# EAGLE schematic icontroller (EAGLE 5.02)
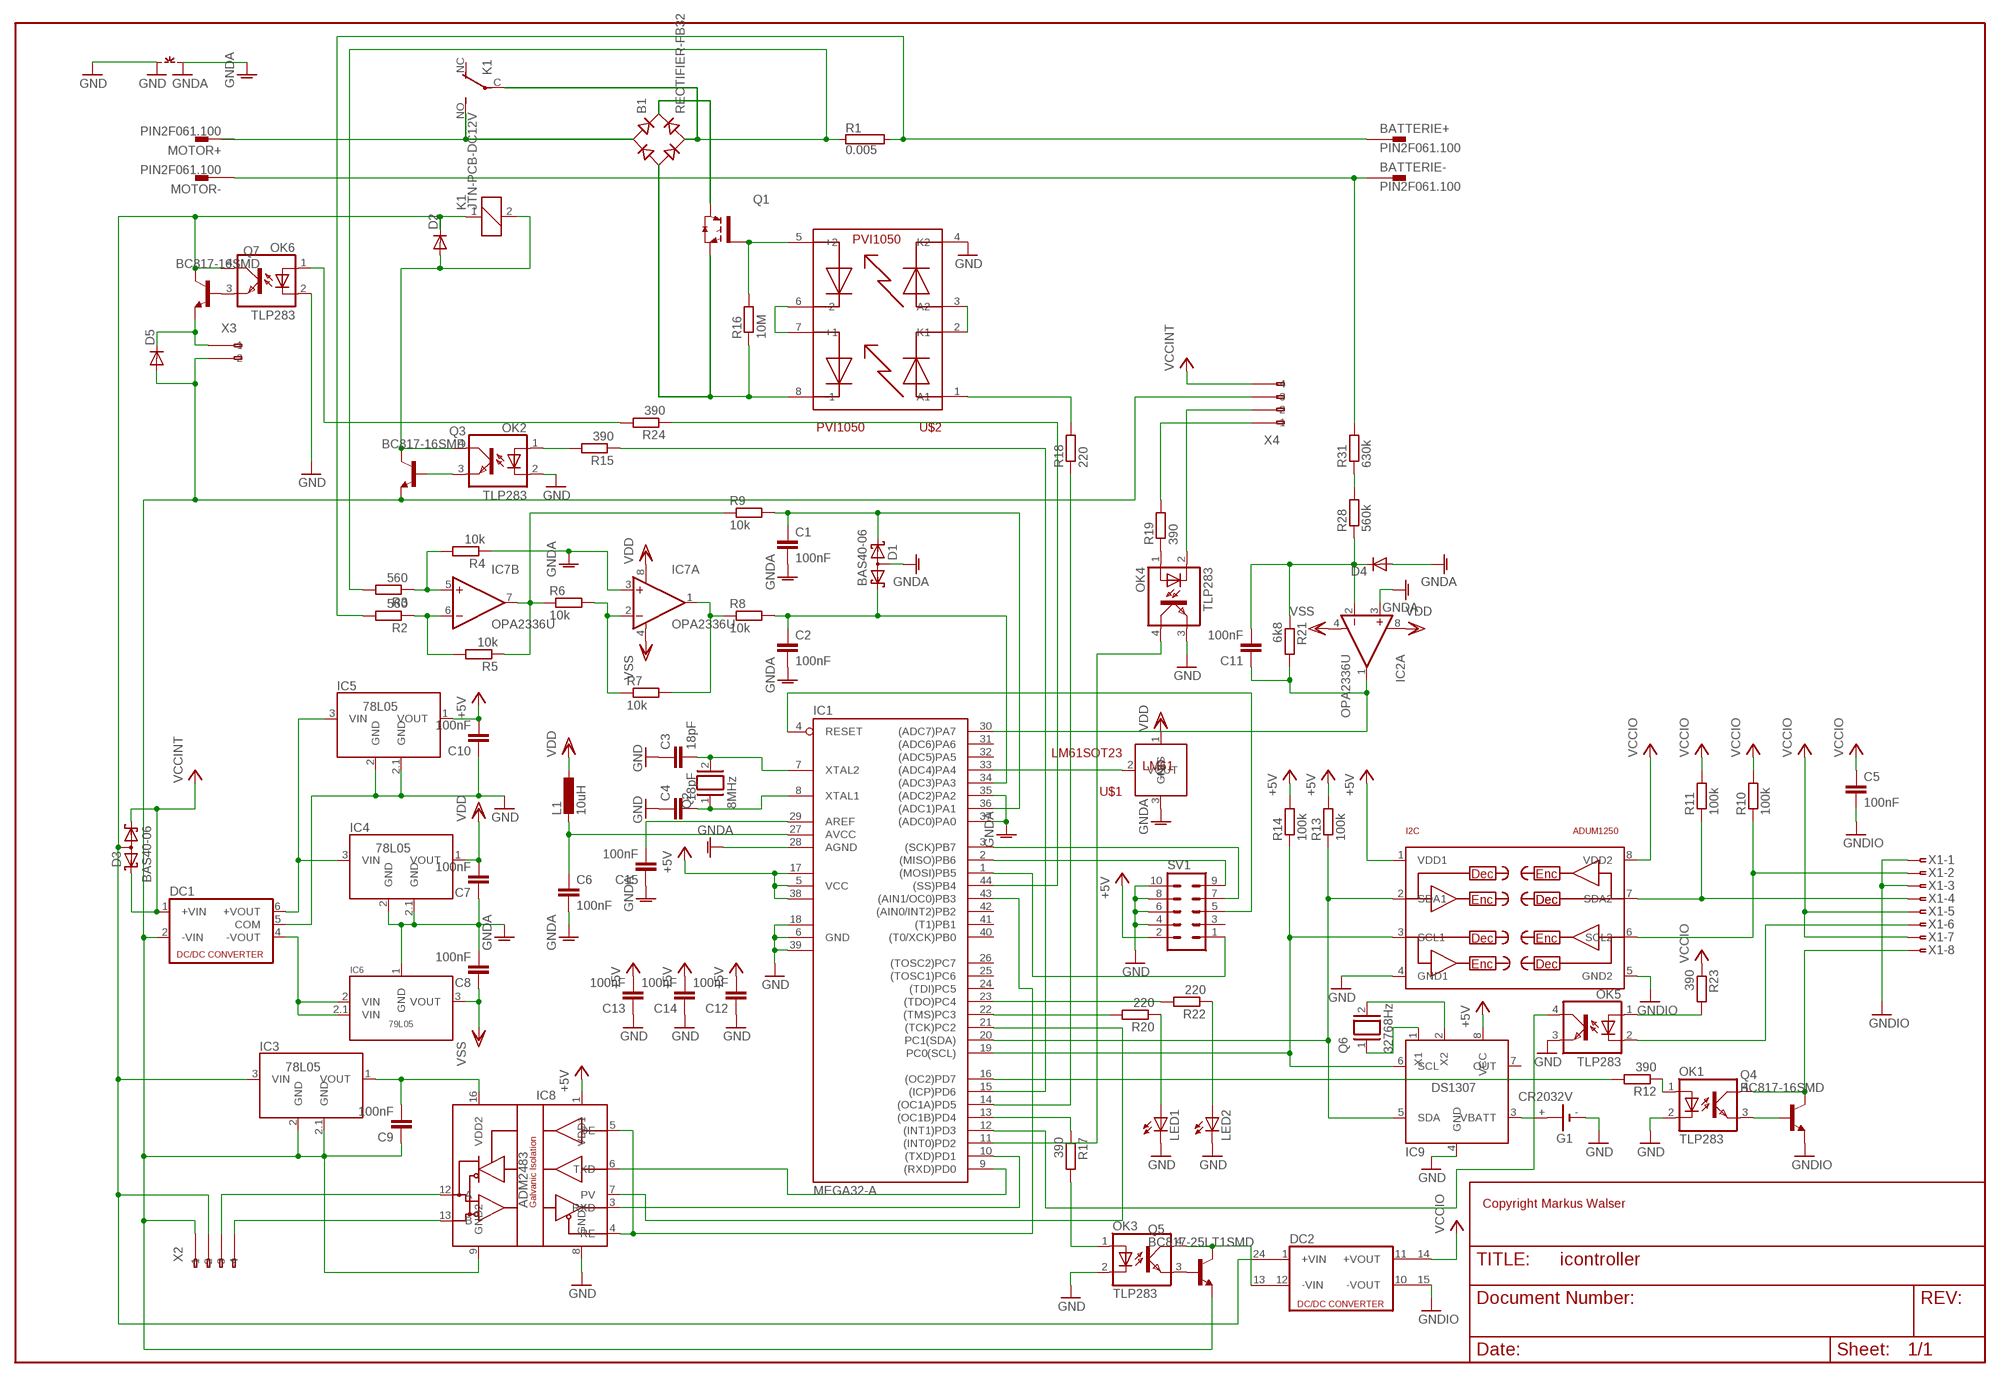
[diagram p0: schematic, sheet 1]

## Parts
B1  RECTIFIER-FB32  [FB32]
BATTERIE+  PIN2F061.100  [F061.100]
BATTERIE-  PIN2F061.100  [F061.100]
C1  100nF  C-EUC0603K  [C0603K]
C2  100nF  C-EUC0603K  [C0603K]
C3  18pF  C-EUC0603K  [C0603K]
C4  18pF  C-EUC0603K  [C0603K]
C5  100nF  C-EUC0603K  [C0603K]
C6  100nF  C-EUC0603K  [C0603K]
C7  100nF  C-EUC0603K  [C0603K]
C8  100nF  C-EUC0603K  [C0603K]
C9  100nF  C-EUC0603K  [C0603K]
C10  100nF  C-EUC0603K  [C0603K]
C11  100nF  C-EUC0603K  [C0603K]
C12  100nF  C-EUC0603K  [C0603K]
C13  100nF  C-EUC0603K  [C0603K]
C14  100nF  C-EUC0603K  [C0603K]
C15  100nF  C-EUC0603K  [C0603K]
D1  BAS40-06  [SOT23]
D2  DIODE-MICROMELF-R  [MICROMELF-R]
D3  BAS40-06  [SOT23]
D4  DIODE-MICROMELF-R  [MICROMELF-R]
D5  DIODE-MICROMELF-R  [MICROMELF-R]
DC1  NMA  [NMA]
DC2  DCW1U  [DCW]
G1  CR2032V  [CR2032V]
I2C  ADUM1250  [SO8]
IC1  MEGA32-A  [TQFP44]
IC2  OPA2336U  [SO08]
IC3  78L05  [SOT89]
IC4  78L05  [SOT89]
IC5  78L05  [SOT89]
IC6  79L05  [SOT89]
IC7  OPA2336U  [SO08]
IC8  ADM2483  [SO16W]
IC9  DS1307  [SO08]
K1  JTN-PCB-DC12V  [JT-PCB]
L1  10uH  L-EUL3225M  [L3225M]
LED1  LEDCHIPLED_0805  [CHIPLED_0805]
LED2  LEDCHIPLED_0805  [CHIPLED_0805]
MOTOR+  PIN2F061.100  [F061.100]
MOTOR-  PIN2F061.100  [F061.100]
OK1  TLP283  [MINI-FLAT-4]
OK2  TLP283  [MINI-FLAT-4]
OK3  TLP283  [MINI-FLAT-4]
OK4  TLP283  [MINI-FLAT-4]
OK5  TLP283  [MINI-FLAT-4]
OK6  TLP283  [MINI-FLAT-4]
Q1  IRG4BC15UD-S  [D2PACK]
Q2  8MHz  XTAL/S  [QS]
Q3  BC817-16SMD  [SOT23-BEC]
Q4  BC817-16SMD  [SOT23-BEC]
Q5  BC817-25LT1SMD  [SOT23-BEC]
Q6  32768Hz  XTAL/S  [QS]
Q7  BC817-16SMD  [SOT23-BEC]
R1  0.005  RKH206-8  [KH206-8]
R2  560  R-EU_M0805  [M0805]
R3  560  R-EU_M0805  [M0805]
R4  10k  R-EU_M0805  [M0805]
R5  10k  R-EU_M0805  [M0805]
R6  10k  R-EU_M0805  [M0805]
R7  10k  R-EU_M0805  [M0805]
R8  10k  R-EU_M0805  [M0805]
R9  10k  R-EU_M0805  [M0805]
R10  100k  R-EU_M0805  [M0805]
R11  100k  R-EU_M0805  [M0805]
R12  390  R-EU_M0805  [M0805]
R13  100k  R-EU_M0805  [M0805]
R14  100k  R-EU_M0805  [M0805]
R15  390  R-EU_M0805  [M0805]
R16  10M  R-EU_M0805  [M0805]
R17  390  R-EU_M0805  [M0805]
R18  220  R-EU_M0805  [M0805]
R19  390  R-EU_M0805  [M0805]
R20  220  R-EU_M0805  [M0805]
R21  6k8  R-EU_M0805  [M0805]
R22  220  R-EU_M0805  [M0805]
R23  390  R-EU_M0805  [M0805]
R24  390  R-EU_M0805  [M0805]
R28  560k  R-EU_MELF0207W  [MINI_MELF-0207W]
R31  630k  R-EU_MELF0207W  [MINI_MELF-0207W]
SV1  MA05-2  [MA05-2]
U$1  LM61SOT23  [SOT23]
U$2  PVI1050  [DIL08]
X1  FSIDE-8  [FSIDE-8]
X2  233-104  [233-104]
X3  233-102  [233-102]
X4  233-104  [233-104]
~NUDEV~1  GND-GNDA  [GND-GNDA]

## Nets
+5V: C10.2 C12.2 C13.2 C14.2 I2C.1(VDD1) IC1.5(VCC) IC1.17(VCC1) IC1.38(VCC2) IC5.1(VOUT) IC8.1(VDD1) IC9.8(VCC) R13.2 R14.2 SV1.2
GND: C3.1 C4.1 C10.1 C12.1 C13.1 C14.1 DC1.5(COM) G1.- I2C.4(GND1) IC1.6(GND) IC1.18(GND1) IC1.39(GND2) IC5.2(GND) IC5.2.1(GND) IC8.8(GND1) IC9.4(GND) LED1.C LED2.C OK1.2(C) OK2.2(C) OK3.2(C) OK4.3(EMIT) OK5.3(EMIT) OK6.2(C) SV1.4 SV1.6 SV1.8 SV1.10 U$2.4(K2) ~NUDEV~1.GND
GNDA: C1.2 C2.2 C6.2 C7.1 C8.2 C15.1 D1.3(AA) D4.A IC1.28(AGND) IC1.35((ADC2)PA2) IC1.37((ADC0)PA0) IC2.3(A:+IN) IC4.2(GND) IC4.2.1(GND) IC6.1(GND) IC7.3(A:+IN) R4.1 U$1.3(GND) ~NUDEV~1.GNDA
GNDIO: C5.2 DC2.15(-VOUT1) I2C.5(GND2) Q4.E X1.1 X1.3
N$1: B1.+ Q1.2(C)
N$2: B1.- Q1.3(E) R16.1 U$2.8(-1)
N$3: B1.AC2 K1.C(P) R1.1 R3.2
N$4: IC7.2(A:-IN) R6.2 R7.1
N$5: IC7.5(B:+IN) R3.1 R4.2
N$6: IC7.6(B:-IN) R2.1 R5.2
N$7: IC7.7(B:OUT) R5.1 R6.1 R9.1
N$8: IC7.1(A:OUT) R7.2 R8.1
N$9: DC1.4(-VOUT) IC6.2(VIN) IC6.2.1(VIN)
N$10: C1.1 D1.2(K2) IC1.36((ADC1)PA1) R9.2
N$11: C2.1 D1.1(K1) IC1.34((ADC3)PA3) R8.2
N$12: C3.2 IC1.7(XTAL2) Q2.2
N$13: C4.2 IC1.8(XTAL1) Q2.1
N$14: I2C.6(SCL2) R10.1 X1.2
N$15: I2C.7(SDA2) R11.1 X1.4
N$16: Q1.1(G) R16.2 U$2.5(+2)
N$17: OK1.4(COL) Q4.C X1.8
N$18: OK1.1(A) R12.1
N$19: IC1.16((OC2)PD7) R12.2
N$20: OK2.3(EMIT) Q3.B
N$21: OK2.1(A) R15.2
N$22: C6.1 IC1.27(AVCC) L1.2
N$23: I2C.2(SDA1) IC1.20(PC1(SDA)) IC9.5(SDA) R13.1
N$24: I2C.3(SCL1) IC1.19(PC0(SCL)) IC9.6(SCL) R14.1
N$25: IC1.15((ICP)PD6) R15.1
N$26: D2.C D3.3(AA) DC2.24(+VIN1) IC3.3(VIN) K1.1 OK6.4(COL) Q7.C X2.A2(-2)
N$27: C9.1 D5.A DC1.2(-VIN) IC3.2(GND) IC3.2.1(GND) IC8.9(GND2) Q3.E Q5.E X2.A1(-1) X3.A2(-2) X4.A3(-3)
N$28: D2.A K1.2 OK2.4(COL) Q3.C
N$29: OK1.3(EMIT) Q4.B
N$30: U$2.6(-2) U$2.7(+1)
N$31: IC1.14((OC1A)PD5) R18.1
N$32: R18.2 U$2.1(A1)
N$33: U$2.2(K1) U$2.3(A2)
N$34: IC1.9((RXD)PD0) IC8.6(TXD)
N$35: IC1.10((TXD)PD1) IC8.3(RXD)
N$36: IC8.13(B) X2.A4(-4)
N$37: C9.2 IC3.1(VOUT) IC8.16(VDD2)
N$38: IC8.12(A) X2.A3(-3)
N$39: IC1.43((AIN1/OC0)PB3) IC8.4(RE) IC8.5(DE)
N$40: IC1.21((TCK)PC2) IC8.7(PV)
N$41: BATTERIE-.A1 MOTOR-.A1 R31.2
N$42: R28.2 R31.1
N$44: DC2.13(-VIN1) OK3.4(COL) Q5.C
N$45: OK3.3(EMIT) Q5.B
N$46: OK3.1(A) R17.2
N$47: IC1.13((OC1B)PD4) R17.1
N$48: IC1.11((INT0)PD2) OK4.4(COL)
N$49: OK4.2(C) X4.A2(-2)
N$50: OK4.1(A) R19.1
N$51: G1.+ IC9.3(VBATT)
N$52: IC1.33((ADC4)PA4) U$1.2(VOUT)
N$53: IC1.3((SCK)PB7) SV1.7
N$54: IC1.4(RESET) SV1.5
N$55: IC1.1((MOSI)PB5) SV1.1
N$56: IC1.2((MISO)PB6) SV1.9
N$57: DC1.6(+VOUT) IC4.3(VIN) IC5.3(VIN)
N$58: R19.2 X4.A1(-1)
N$59: C15.2 IC1.29(AREF)
N$60: B1.AC1 K1.NO(S) MOTOR+.A1 MOTOR+.A2(1.1)
N$61: BATTERIE+.A1 R1.2 R2.2
N$62: IC9.1(X1) Q6.1
N$63: IC9.2(X2) Q6.2
N$64: LED2.A R22.1
N$65: IC1.23((TDO)PC4) R22.2
N$66: IC1.22((TMS)PC3) R20.2
N$67: C11.2 D4.C IC2.2(A:-IN) R21.1 R28.1
N$68: LED1.A R20.1
N$69: OK5.1(A) R23.2
N$70: C11.1 IC1.30((ADC7)PA7) IC2.1(A:OUT) R21.2
N$71: OK5.2(C) X1.6
N$72: IC1.12((INT1)PD3) OK5.4(COL)
N$73: OK6.3(EMIT) Q7.B
N$74: OK6.1(A) R24.2
N$76: IC1.44((SS)PB4) R24.1
N$77: D5.C Q7.E X3.A1(-1)
VCCINT: D3.1(K1) D3.2(K2) DC1.1(+VIN) X4.A4(-4)
VCCIO: C5.1 DC2.14(+VOUT1) I2C.8(VDD2) R10.2 R11.2 R23.1 X1.5 X1.7
VDD: C7.2 IC2.8(A:V+) IC4.1(VOUT) IC7.8(A:V+) L1.1 U$1.1(+VS)
VSS: C8.1 IC2.4(A:V-) IC6.3(VOUT) IC7.4(A:V-)
Unconnected: BATTERIE+.A2(1.1) BATTERIE-.A2(1.1) DC2.1(+VIN) DC2.10(-VOUT) DC2.11(+VOUT) DC2.12(-VIN) G1.+@1(+) IC1.24((TDI)PC5) IC1.25((TOSC1)PC6) IC1.26((TOSC2)PC7) IC1.31((ADC6)PA6) IC1.32((ADC5)PA5) IC1.40((T0/XCK)PB0) IC1.41((T1)PB1) IC1.42((AIN0/INT2)PB2) IC2.5(B:+IN) IC2.6(B:-IN) IC2.7(B:OUT) IC9.7(OUT) K1.NC(O) MOTOR-.A2(1.1) SV1.3 X2.B1(B-1) X2.B2(B-2) X2.B3(B-3) X2.B4(B-4) X3.B1(B-1) X3.B2(B-2) X4.B1(B-1) X4.B2(B-2) X4.B3(B-3) X4.B4(B-4)

## Notes on the sheet
- Copyright Markus Walser

## Library data of the parts
B1 = rectifier:RECTIFIER-: Rectifier
BATTERIE+ BATTERIE- MOTOR+ MOTOR- = con-faston:PIN2: Flachstecker Typ tyco/Electronics/AMP Source: http://www.buerklin.com
C1-C15 = rcl:C-EU: CAPACITOR, European symbol
D1 D3 = diode:BAS40-06: Silicon Schottky Diodes General-purpose diode for high-speed switching
D2 D4 D5 = diode:DIODE-: DIODE
DC1 = dc-dc-converter:NMA: DC-DC CONVERTER
DC2 = dc-dc-converter:DCW1U: DC-DC CONVERTER
G1 = battery:CR2032V: LI BATTERY Varta
I2C = analog-devices:ADUM1250
IC1 = atmel:MEGA32: MICROCONTROLLER 32 Kbytes FLASH 2 Kbytes SRAM 1 Kbytes EEPROM USART 8-channel 10 bit ADC Source: www.atmel.com .. doc2503.pdf
IC2 IC7 = burr-brown:OPA2336: Single-Supply, MicroPower CMOS Operational Amplifiers MicroAmplifier Series; Product Folder:OPA2336,
IC3-IC5 = icontroller:78L05: Negative voltage regulators
IC6 = icontroller:79L05: Negative voltage regulators
IC8 = icontroller:ADM2483: RS-485 Transceiver, iCoupler® Isolated, Half-Duplex
IC9 = icontroller:DS1307: 64 x 8, Serial, I2C Real-Time Clock
K1 = relay:JT?-*: COMPACT ECONOMICAL 30 AMP. RELAY NAiS Source: http://www.mew-europe.com/.. en_ds_61212_0000.pdf
L1 = rcl:L-EU: INDUCTOR, European symbol
LED1 LED2 = led:LED: LED OSRAM: - CHIPLED LG R971, LG N971, LY N971, LG Q971, LY Q971, LO R971, LY R971 LH N974, LH R974 LS Q976, LO Q976, LY Q976 LO Q996 - Hyper CHIPLED LW Q18S LB Q993, LB Q99A, LB R99A - SideLED LS A670, LO A670, LY A670, LG A670, LP A670 LB A673, LV A673, LT A673, LW A673 LH A674 LY A675 LS A676, LA A676, LO A676, LY A676, LW A676 LS A679, LY A679, LG A679 - Hyper Micro SIDELED® LS Y876, LA Y876, LO Y876, LY Y876 LT Y87S - SmartLED LW L88C, LW L88S LB L89C, LB L89S, LG L890 LS L89K, LO L89K, LY L89K LS L896, LA L896, LO L896, LY L896 - TOPLED LS T670, LO T670, LY T670, LG T670, LP T670 LSG T670, LSP T670, LSY T670, LOP T670, LYG T670 LG T671, LOG T671, LSG T671 LB T673, LV T673, LT T673, LW T673 LH T674 LS T676, LA T676, LO T676, LY T676, LB T676, LH T676, LSB T676, LW T676 LB T67C, LV T67C, LT T67C, LS T67K, LO T67K, LY T67K, LW E67C LS E67B, LA E67B, LO E67B, LY E67B, LB E67C, LV E67C, LT E67C LW T67C LS T679, LY T679, LG T679 LS T770, LO T770, LY T770, LG T770, LP T770 LB T773, LV T773, LT T773, LW T773 LH T774 LS E675, LA E675, LY E675, LS T675 LS T776, LA T776, LO T776, LY T776, LB T776 LHGB T686 LT T68C, LB T68C - Hyper Mini TOPLED® LB M676 - Mini TOPLED Santana® LG M470 LS M47K, LO M47K, LY M47K Source: http://www.osram.convergy.de - LUMILED® LXK2-PW12-R00, LXK2-PW12-S00, LXK2-PW14-U00, LXK2-PW14-V00 LXK2-PM12-R00, LXK2-PM12-S00, LXK2-PM14-U00 LXK2-PE12-Q00, LXK2-PE12-R00, LXK2-PE12-S00, LXK2-PE14-T00, LXK2-PE14-U00 LXK2-PB12-K00, LXK2-PB12-L00, LXK2-PB12-M00, LXK2-PB14-N00, LXK2-PB14-P00, LXK2-PB14-Q00 LXK2-PR12-L00, LXK2-PR12-M00, LXK2-PR14-Q00, LXK2-PR14-R00 LXK2-PD12-Q00, LXK2-PD12-R00, LXK2-PD12-S00 LXK2-PH12-R00, LXK2-PH12-S00 LXK2-PL12-P00, LXK2-PL12-Q00, LXK2-PL12-R00 Source: www.luxeon.com
OK1-OK6 = optocoupler:TLP283: TOSHIBA PHOTOCOUPLER GaAs IRED & PHOTO-TRANSISTOR Source: http://www.semicon.toshiba.co.jp/td/en/Opto/Photocoupler/en_20050928_TLP283_datasheet.pdf
Q1 = transistor-power:IRG4BC15UD-: INSULATED GATE BIPOLAR TRANSISTOR WITH ULTRAFAST SOFT RECOVERY DIODE
Q2 Q6 = special:XTAL/S: CRYSTAL
Q3-Q5 Q7 = transistor-npn:BC817*: NPN Transistor
R1 = resistor-power:R: Power Resitor
R2-R24 R28 R31 = rcl:R-EU_: RESISTOR, European symbol
SV1 = con-lstb:MA05-2: PIN HEADER
U$1 = linear:LM61
U$2 = ir:PVI1050
X1 = con-amp:FSIDE-8: AMP connector
X2 X4 = con-wago:233-104: WAGO Cage Clamp
X3 = con-wago:233-102: WAGO Cage Clamp
~NUDEV~1 = supply1:GND-GNDA: Example of GND--GNDA NET-Connetor for more info see description in package